# EAGLE design WemosD1_R2_THT (EAGLE 9.6.2)
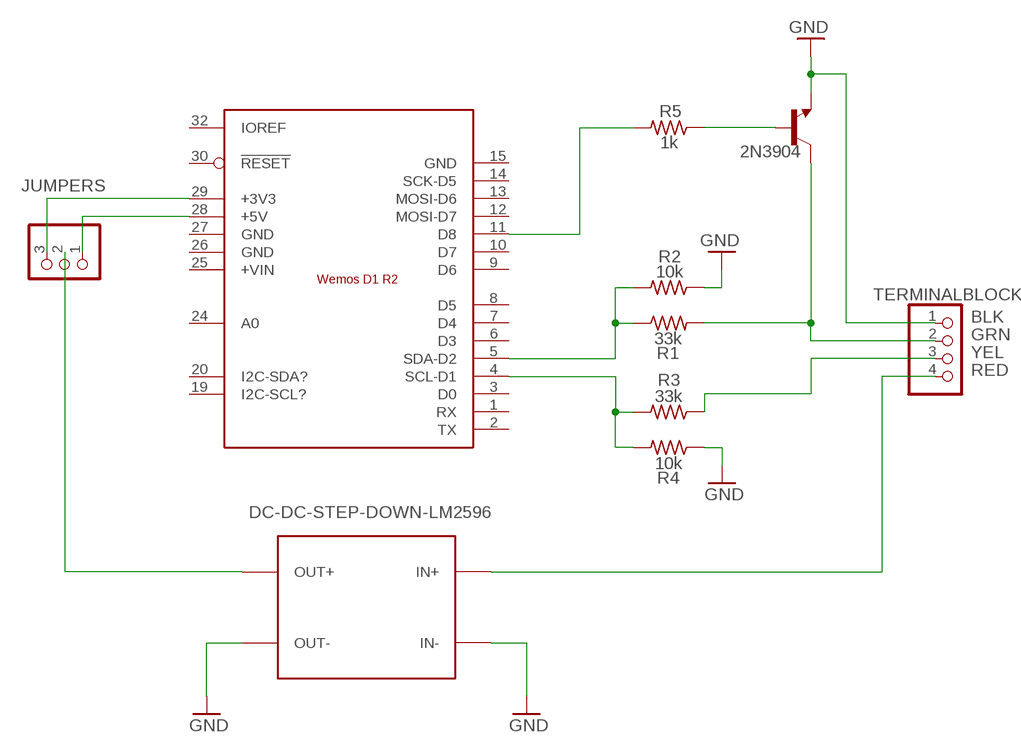
[diagram p0: schematic, sheet 1]

## Parts
JUMPERS  PINHD-1X3  [1X03]
R1  33k  R-US_0204/7  [0204/7]
R2  10k  R-US_0204/7  [0204/7]
R3  33k  R-US_0204/7  [0204/7]
R4  10k  R-US_0204/7  [0204/7]
R5  1k  R-US_0204/7  [0204/7]
T1  2N3904  [TO92]
TERMINALBLOCK  PINHD-1X4  [1X04]
U$1  WEMOS_D1_R2  [WEMOS_D1_R2]
U$2  DC-DC-STEP-DOWN-LM2596  [DC-DC-STEP-DOWN-LM2596]

## Nets
GND: R2.1 R4.1 T1.3(E) TERMINALBLOCK.1 U$2.IN- U$2.OUT-
N$1: R1.1 R2.2 U$1.5(SDA-D2)
N$2: JUMPERS.2 U$2.OUT+
N$3: R3.2 R4.2 U$1.4(SCL-D1)
N$4: R3.1 TERMINALBLOCK.3
N$5: TERMINALBLOCK.4 U$2.IN+
N$7: R5.1 T1.2(B)
N$8: R5.2 U$1.11(D8)
N$9: JUMPERS.3 U$1.29(+3V3)
N$10: JUMPERS.1 U$1.28(+5V)
N$15: R1.2 T1.1(C) TERMINALBLOCK.2
Unconnected: U$1.1(RX) U$1.2(TX) U$1.3(D0) U$1.6(D3) U$1.7(D4) U$1.8(D5) U$1.9(D6) U$1.10(D7) U$1.12(MOSI-D7) U$1.13(MOSI-D6) U$1.14(SCK-D5) U$1.19(I2C-SCL?) U$1.20(I2C-SDA?) U$1.24(A0) U$1.25(+VIN) U$1.30(!RESET) U$1.32(IOREF)

## Notes on the sheet
- BLK
- GRN
- YEL
- RED

## Power pins joined to a net without a drawn wire
GND: U$1.15(GND) U$1.26(GND) U$1.27(GND)

## Library data of the parts
JUMPERS = pinheadDSC1:PINHD-1X3: PIN HEADER
R1-R5 = rcl:R-US_: RESISTOR, American symbol; SPICEPREFIX: R
T1 = transistor:2N3904: NPN TRANSISTOR
TERMINALBLOCK = pinhead:PINHD-1X4: PIN HEADER
U$1 = arduino:WEMOS_D1_R2
U$2 = diy-modules:DC-DC-STEP-DOWN-LM2596: DC/DC Step-Down Regulator based on LM2596-ADJ chip LM2596 datasheet available here: http://www.ti.com/lit/ds/symlink/lm2596.pdf Click here to find device on ebay.com <http://www.ebay.com/sch/lm2596+power+regulator>

## Board
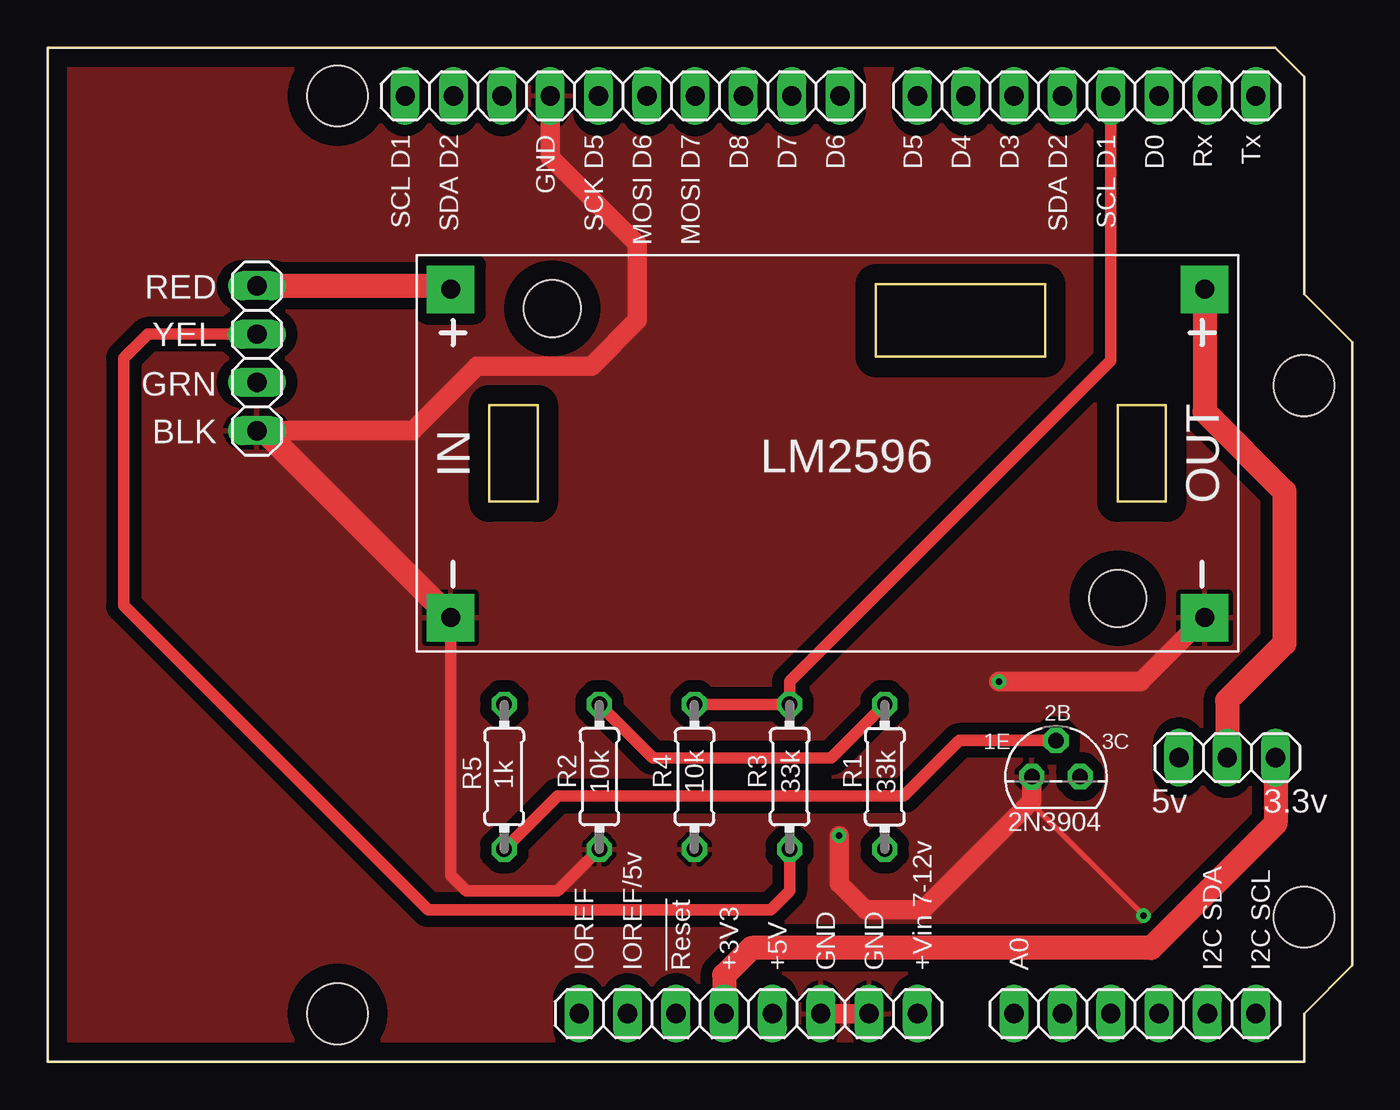
[diagram p1: board, top side]
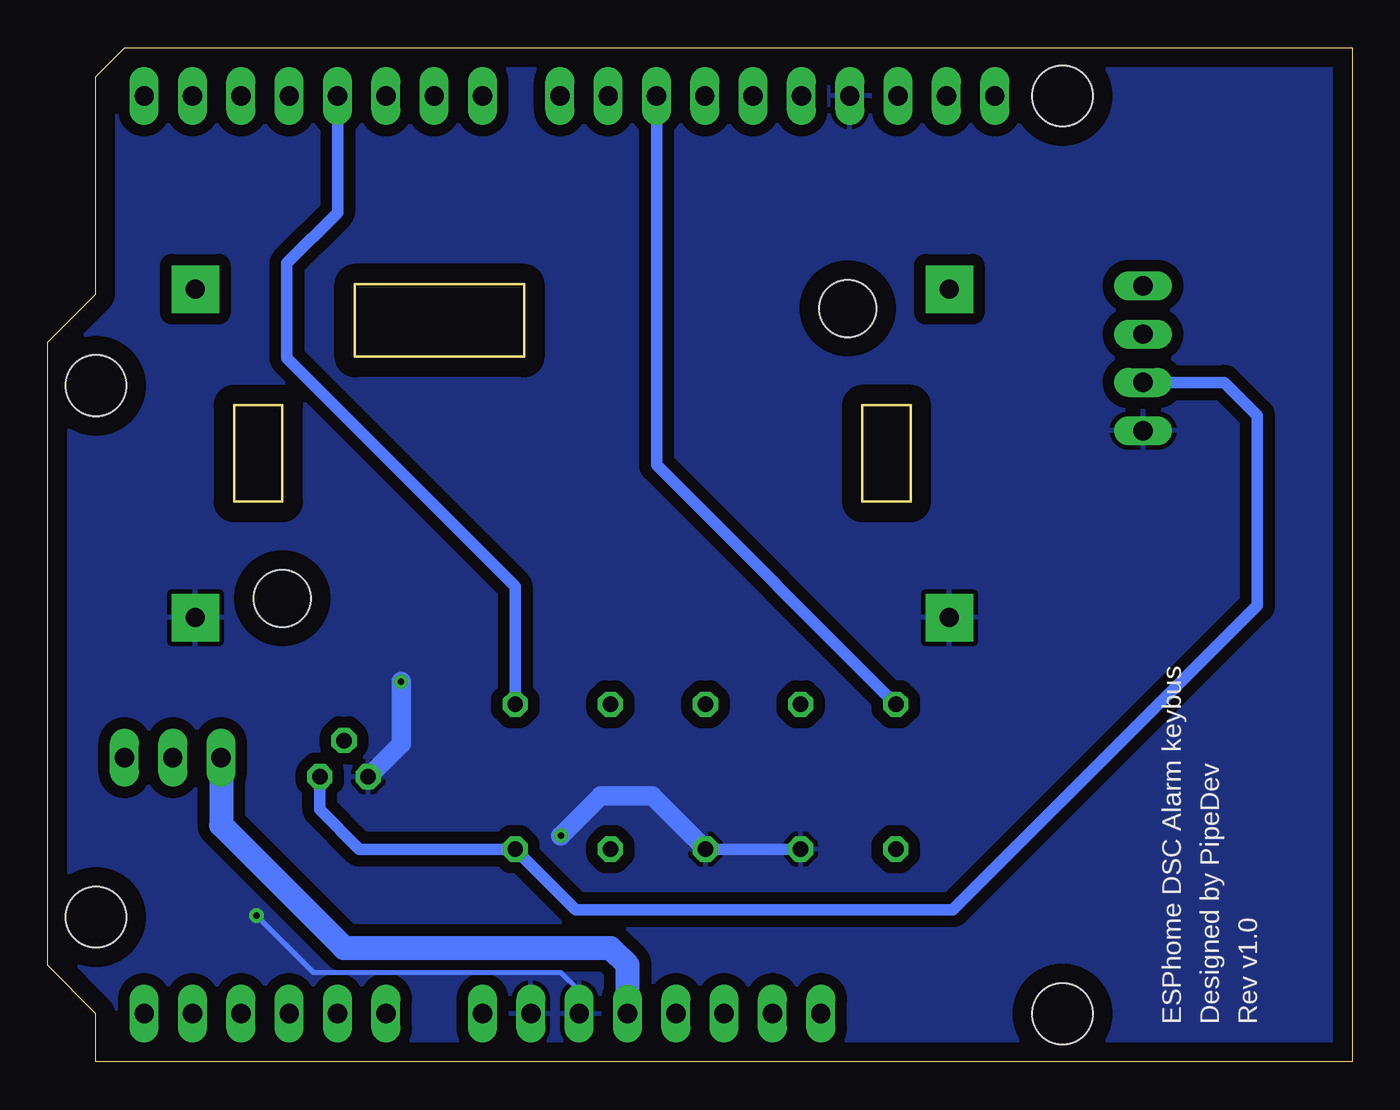
[diagram p2: board, bottom side, seen from below]

Size 68.58 x 53.34 mm. Coordinates in mm from the lower left corner, seen from the top.
Outline: 0,0 66.04,0 66.04,2.54 68.58,5.08 68.58,37.85 66.04,40.39 66.04,51.82 64.52,53.34 0,53.34 0,0
Copper layers (1*16): Top 0.035mm / dielectric 1.5mm / Bottom 0.035mm
Design rules "default": minimum track width 6mil, minimum drill 0.35mm, track to track 6mil, track to pad 6mil, pad to pad 6mil, via to via 6mil, smd to smd 6mil, copper to edge 40mil, drill to drill 6mil, minimum pad ring 10mil, minimum via ring 8mil, stop-mask expansion 4mil, vias tented up to drill 0mil, thermal gap 10mil

### Footprints (pad centres in the part's own frame; a part is rotated, then mirrored left to right if it is on the bottom)
1X03 = drill 1.016 long: 1 -2.54,0; 2 0,0; 3 2.54,0
0204/7 = drill 0.813 octagon: 1 -3.81,0; 2 3.81,0
TO92 = drill 0.813 octagon: 1 1.27,0; 2 0,1.905; 3 -1.27,0
1X04 = drill 1.016 long: 1 -3.81,0; 2 -1.27,0; 3 1.27,0; 4 3.81,0
WEMOS_D1_R2 = drill 1.016 long: 1 63.5,50.8; 2 60.96,50.8; 3 58.42,50.8; 4 55.88,50.8; 5 53.34,50.8; 6 50.8,50.8; 7 48.26,50.8; 8 45.72,50.8; 9 41.656,50.8; 10 39.116,50.8; 11 36.576,50.8; 12 34.036,50.8; 13 31.496,50.8; 14 28.956,50.8; 15 26.416,50.8; 16 23.876,50.8; 17 21.336,50.8; 18 18.796,50.8; 19 63.5,2.54; 20 60.96,2.54; 21 58.42,2.54; 22 55.88,2.54; 23 53.34,2.54; 24 50.8,2.54; 25 45.72,2.54; 26 43.18,2.54; 27 40.64,2.54; 28 38.1,2.54; 29 35.56,2.54; 30 33.02,2.54; 31 30.48,2.54; 32 27.94,2.54 | hole 3.2: 15.24,50.8; 66.04,35.56; 66.04,7.62; 15.24,2.54
DC-DC-STEP-DOWN-LM2596 = drill 1 pad 2.5 square: IN+ -19.812,8.636; IN- -19.812,-8.636; OUT+ 19.812,8.636; OUT- 19.812,-8.636 | hole 3: -14.478,7.62; 15.24,-7.62

### Placement (x,y rotation side)
JUMPERS  62,16 0 top
R1  44,15 270 top
R2  29,15 90 top
R3  39,15 90 top
R4  34,15 90 top
R5  24,15 90 top
T1  53,15 0 top
TERMINALBLOCK  11,37 90 top
U$1  0,0 0 top
U$2  41,32 0 top

### Tracks (layer width: path | path; a pad name or v marks a point on that pad's centre or on a via)
GND  (via drill 0.35)
  Top 0.254: v57.6,7.7 51.73,13.57 T1.3
  Top 0.61: R2.1 26.81,9 22,9 21.19,9.81 U$2.IN-
  Top 1.016: TERMINALBLOCK.1 19.19,33.19 22.6,36.6 28.6,36.6 31,39 31,43 26.42,47.58 U$1.15 | U$1.27 U$1.26 | U$2.OUT- 57.45,20 v50,20 | T1.3 51.73,13.73 46,8 43,8 41.6,9.4 v41.6,11.9
  Top 1.27: U$2.IN- 11.36,33.19 TERMINALBLOCK.1
  Bottom 0.254: U$1.27 40.64,3.74 41.6,4.7 54.6,4.7 v57.6,7.7
  Bottom 0.61: R4.1 R2.1
  Bottom 1.016: T1.3 50,16.73 v50,20 | R4.1 36.81,14 39.5,14 v41.6,11.9
  pour Top (isolate 0.61): 0,0 0,53.34 64.52,53.34 66.04,51.82 66.04,40.39 68.58,37.85 68.58,5.08 66.04,2.54 66.04,0
  pour Bottom (isolate 0.61): 0,0 0,53.34 64.52,53.34 66.04,51.82 66.04,40.39 68.58,37.85 68.58,5.08 66.04,2.54 66.04,0
N$1
  Top 0.61: R1.1 41.19,16 31.81,16 R2.2
  Bottom 0.61: U$1.5 53.34,44.66 56,42 56,37 44,25 R1.1
N$2
  Top 1.27: U$2.OUT+ 60.81,34.19 65,30 65,22 62,19 JUMPERS.2
N$3
  Top 0.61: U$1.4 55.88,36.88 39,20 R3.2 R4.2
N$4
  Top 0.61: TERMINALBLOCK.3 5.27,38.27 4,37 4,24 20,8 38,8 39,9 R3.1
N$5
  Top 1.27: TERMINALBLOCK.4 21.01,40.81 U$2.IN+
N$7
  Top 0.61: R5.1 26.81,14 42,14 43,14 45,14 47.91,16.91 T1.2
N$8
  Bottom 0.61: R5.2 36.58,31.39 U$1.11
N$9
  Top 1.27: JUMPERS.3 64.54,12.54 58,6 37,6 35.56,4.56 U$1.29
N$10
  Bottom 1.27: U$1.28 38.1,5.1 39,6 53,6 59.46,12.46 JUMPERS.1
N$15
  Bottom 0.61: T1.1 54.27,13.27 52.19,11.19 R1.2 40.81,8 21,8 5,24 5,34 6.73,35.73 TERMINALBLOCK.2

### Text on the board
tNames: RED | YEL | GRN | BLK | LM2596 | 2B | 1E | 3C | 1k | 10k | 10k | 33k | 33k | 5v | 3.3v | 2N3904
bNames: Rev v1.0 | Designed by PipeDev | ESPhome DSC Alarm keybus